# Altium schematic sheet Modem.SchDoc
size A4; SheetNumber: 2; SheetTotal: 2
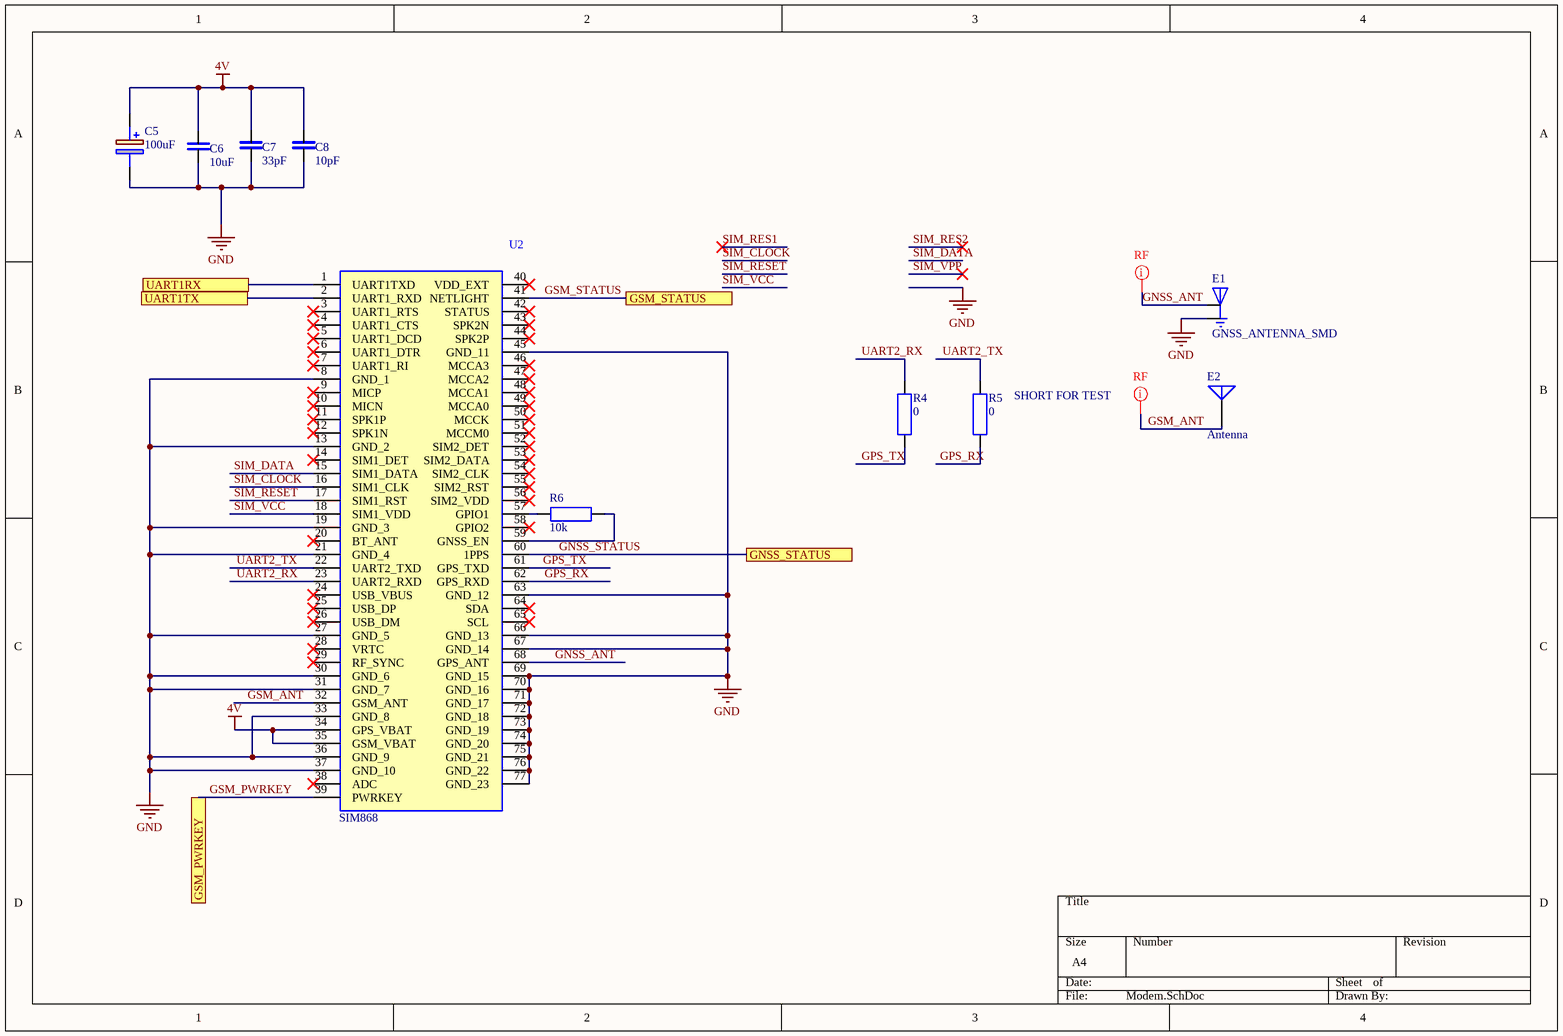
[diagram p0: Modem.SchDoc]

## Parts
C5  100uF  [TANTALUM_CAP_0805]
C6  10uF  [CAP_0805]
C7  33pF  [CAP_0805]
C8  10pF  [CAP_0805]
E1  GNSS_ANTENNA_SMD  [GNSS_ANTENNA_SMD]
E2  Antenna  [PIN1]
R4  0  [RES_0805]
R5  0  [RES_0805]
R6  10k  [RES_0805]
U2  GPRS,GSM,GNSS Modem  [SIM868]  (value not drawn)

## Ports
GNSS_STATUS, GSM_PWRKEY, GSM_STATUS, UART1RX, UART1TX

## Nets
4V: C5.1(+) C6.2 C7.2 C8.2 U2.34(GPS_VBAT) U2.35(GSM_VBAT)
GND: C5.2(-) C6.1 C7.1 C8.1 E1.2(GND) U2.8(GND_1) U2.13(GND_2) U2.19(GND_3) U2.21(GND_4) U2.27(GND_5) U2.30(GND_6) U2.31(GND_7) U2.33(GND_8) U2.36(GND_9) U2.37(GND_10) U2.45(GND_11) U2.63(GND_12) U2.66(GND_13) U2.67(GND_14) U2.69(GND_15) U2.70(GND_16) U2.71(GND_17) U2.72(GND_18) U2.73(GND_19) U2.74(GND_20) U2.75(GND_21) U2.76(GND_22) U2.77(GND_23)
GNSS_ANT: E1.1(FEEDING) U2.68(GPS_ANT)
GNSS_STATUS: U2.60(1PPS) ; port GNSS_STATUS
GPS_RX: R5.1 U2.62(GPS_RXD)
GPS_TX: R4.1 U2.61(GPS_TXD)
GSM_ANT: E2.1(A) U2.32(GSM_ANT)
GSM_PWRKEY: U2.39(PWRKEY) ; port GSM_PWRKEY
GSM_STATUS: U2.41(NETLIGHT) ; port GSM_STATUS
SIM_CLOCK: U2.16(SIM1_CLK)
SIM_DATA: U2.15(SIM1_DATA)
SIM_RESET: U2.17(SIM1_RST)
SIM_VCC: U2.18(SIM1_VDD)
UART1RX: U2.1(UART1TXD) ; port UART1RX
UART1TX: U2.2(UART1_RXD) ; port UART1TX
UART2_RX: R4.2 U2.23(UART2_RXD)
UART2_TX: R5.2 U2.22(UART2_TXD)
NetR6_1: R6.1 U2.57(GPIO1)
NetR6_2: R6.2 U2.59(GNSS_EN)

Not connected (* = marked no-connect by the designer): U2 3(UART1_RTS)* 4(UART1_CTS)* 5(UART1_DCD)* 6(UART1_DTR)* 7(UART1_RI)* 9(MICP)* 10(MICN)* 11(SPK1P)* 12(SPK1N)* 14(SIM1_DET)* 20(BT_ANT)* 24(USB_VBUS)* 25(USB_DP)* 26(USB_DM)* 28(VRTC)* 29(RF_SYNC)* 38(ADC)* 40(VDD_EXT)* 42(STATUS)* 43(SPK2N)* 44(SPK2P)* 46(MCCA3)* 47(MCCA2)* 48(MCCA1)* 49(MCCA0)* 50(MCCK)* 51(MCCM0)* 52(SIM2_DET)* 53(SIM2_DATA)* 54(SIM2_CLK)* 55(SIM2_RST)* 56(SIM2_VDD)* 58(GPIO2)* 64(SDA)* 65(SCL)*

## Layout directives
net class RF: GNSS_ANT, GSM_ANT

## Notes on the sheet
- (near R5) SHORT FOR TEST

## Library data of the parts
C5 = SMT_TANTALUM_CAP: T491C107K016AT; Manufacturer_Name: KEMET; Geometry.Height: 2.8mm; Manufacturer_Part_Number: T491C107K016AT; Mouser Part Number: 80-T491C107K016AT; Mouser Price/Stock: https://www.mouser.co.uk/ProductDetail/KEMET/T491C107K016AT?qs=Si2vDv5E4YMke5HCn79NYA%3D%3D; Arrow Part Number: T491C107K016AT; Arrow Price/Stock: https://www.arrow.com/en/products/t491c107k016at/kemet-corporation?region=nac; Datasheet Link: https://content.kemet.com/datasheets/KEM_T2005_T491.pdf
C6-C8 = SMT_CAP: MP: LD051A270KAB2A; Package: None; Price: None; Availability: Unavailable
E1 = GNSS_ANTENNA_SMD: Ceramic GNSS antenna 25*25 SMD; MF: Linx; MP: ANT-GNSSCP-TH18L1; Value: *; SnapEDA_Link: https://www.snapeda.com/parts/ANT-GNSSCP-TH18L1/Linx/view-part/?ref=snap; Purchase-URL: https://pricing.snapeda.com/search/part/ANT-GNSSCP-TH18L1/?ref=eda; Availability: In Stock; Price: None; Package: None; Check_prices: https://www.snapeda.com/parts/ANT-GNSSCP-TH18L1/Linx/view-part/?ref=eda
E2 = Antenna: Generic Antenna; Published: 24-Mar-1999; LatestRevisionDate: 17-Jul-2002; LatestRevisionNote: Re-released for DXP Platform.; PackageReference: PIN1; Publisher: Altium Limited
R4-R6 = SMT_RES: Power_Rating: .25 W; MP: 2-2176053-0; Tolerance: 1%; Resistance: .33; MF: TE Connectivity; Price: None; Availability: In Stock; EU_RoHS_Compliance: Compliant with Exemptions; Package: 0805; Value: *; SnapEDA_Link: https://www.snapeda.com/parts/2-2176053-0/TE+Connectivity/view-part/?ref=snap; Check_prices: https://www.snapeda.com/parts/2-2176053-0/TE+Connectivity/view-part/?ref=eda
U2 = SIM868: Manufacturer_Name: SIMCOM; GateName_1: G$1; LibraryName: SIM868; DeviceSetName: SIM868; Package: SIM868; Manufacturer_Part_Number: SIM868; Height: mm; SymbolName_1: SIM868